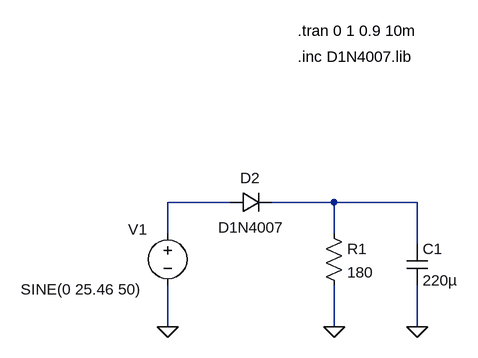
[diagram p0: schematic rectifier.asc]
rectifier.asc, the LTspice schematic file:
Version 4
SHEET 1 880 680
WIRE -96 256 -192 256
WIRE 64 256 -32 256
WIRE 192 256 64 256
WIRE -192 304 -192 256
WIRE 64 304 64 256
WIRE 192 320 192 256
WIRE -192 448 -192 384
WIRE 64 448 64 384
WIRE 192 448 192 384
FLAG -192 448 0
FLAG 64 448 0
FLAG 192 448 0
SYMBOL voltage -192 288 R0
WINDOW 123 0 0 Left 2
WINDOW 39 0 0 Left 2
WINDOW 0 -61 10 Left 2
WINDOW 3 -226 102 Left 2
SYMATTR InstName V1
SYMATTR Value SINE(0 25.46 50)
SYMBOL res 48 288 R0
SYMATTR InstName R1
SYMATTR Value 180
SYMBOL diode -96 272 R270
WINDOW 3 -7 33 VBottom 2
WINDOW 0 38 31 VTop 2
SYMATTR Value D1N4007
SYMATTR InstName D2
SYMBOL cap 176 320 R0
SYMATTR InstName C1
SYMATTR Value 220µ
SYMATTR SpiceLine V=35
TEXT 8 -8 Left 2 !.tran 0 1 0.9 10m
TEXT 8 32 Left 2 !.inc D1N4007.lib

The netlist it stands for:
* rectifier.asc
V1 N001 0 SINE(0 25.46 50)
R1 N002 0 180
D2 N001 N002 D1N4007
C1 N002 0 220µ V=35
.model D D
.lib standard.dio
.tran 0 1 0.9 10m
.inc D1N4007.lib
.backanno
.end